# Altium schematic sheet FPGA_Board_Input_Signals.SchDoc
size B; Organization: Altium Limited; Address1: L3, 12a Rodborough Rd; Address2: Frenchs Forest; Address3: NSW; Address4: Australia 2086; DocumentNumber: 12; SheetNumber: 9; SheetTotal: 21
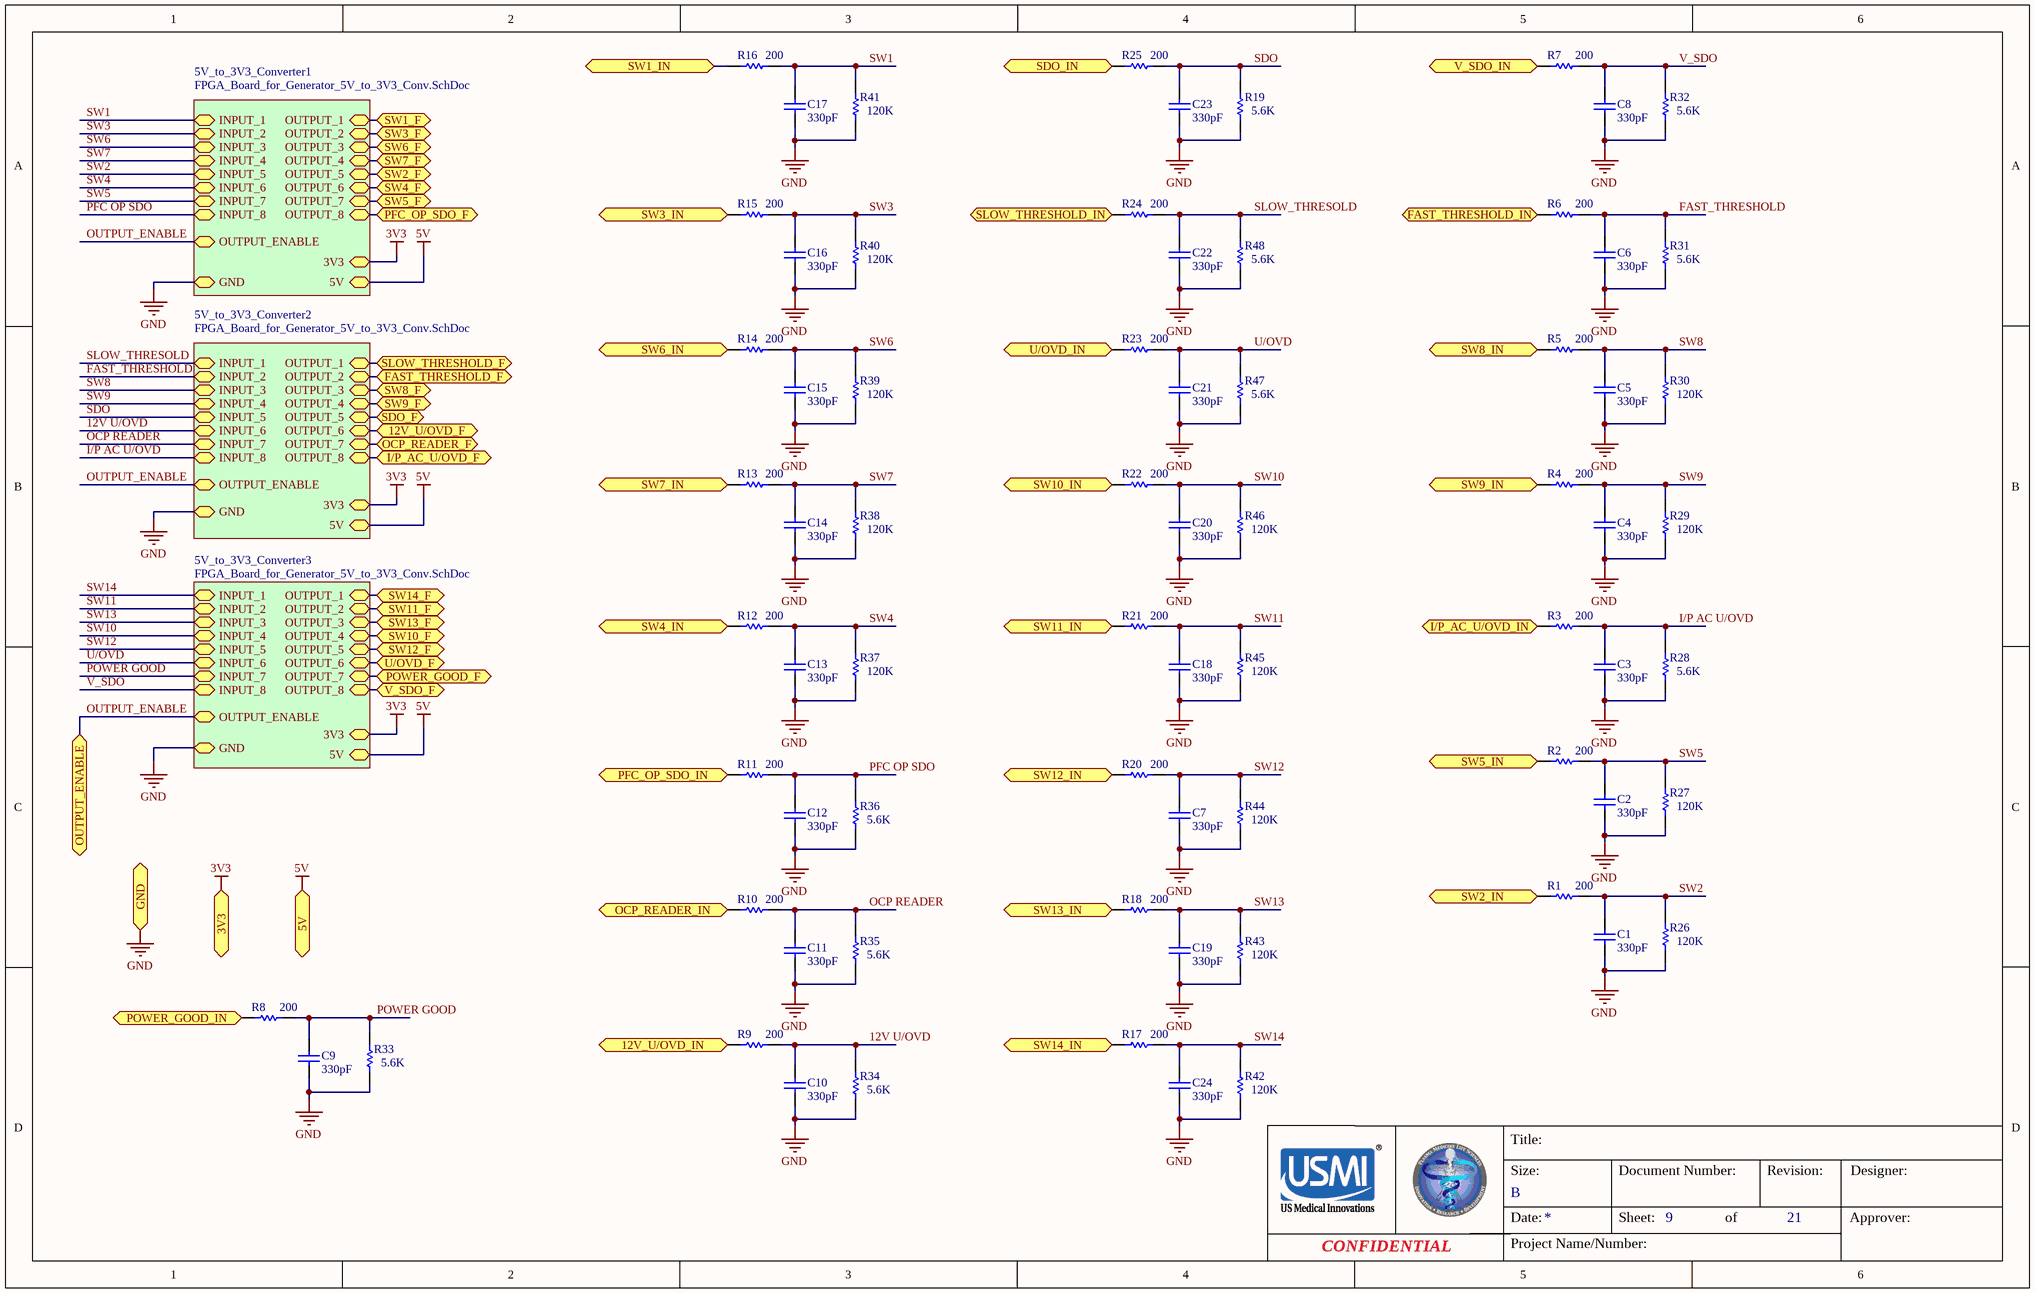
[diagram p0: FPGA_Board_Input_Signals.SchDoc]

## Parts
C1  330pF  [0603c]
C2  330pF  [0603c]
C3  330pF  [0603c]
C4  330pF  [0603c]
C5  330pF  [0603c]
C6  330pF  [0603c]
C7  330pF  [0603c]
C8  330pF  [0603c]
C9  330pF  [0603c]
C10  330pF  [0603c]
C11  330pF  [0603c]
C12  330pF  [0603c]
C13  330pF  [0603c]
C14  330pF  [0603c]
C15  330pF  [0603c]
C16  330pF  [0603c]
C17  330pF  [0603c]
C18  330pF  [0603c]
C19  330pF  [0603c]
C20  330pF  [0603c]
C21  330pF  [0603c]
C22  330pF  [0603c]
C23  330pF  [0603c]
C24  330pF  [0603c]
R1  200  [0603R]
R2  200  [0603R]
R3  200  [0603R]
R4  200  [0603R]
R5  200  [0603R]
R6  200  [0603R]
R7  200  [0603R]
R8  200  [0603R]
R9  200  [0603R]
R10  200  [0603R]
R11  200  [0603R]
R12  200  [0603R]
R13  200  [0603R]
R14  200  [0603R]
R15  200  [0603R]
R16  200  [0603R]
R17  200  [0603R]
R18  200  [0603R]
R19  5.6K  [0603R]
R20  200  [0603R]
R21  200  [0603R]
R22  200  [0603R]
R23  200  [0603R]
R24  200  [0603R]
R25  200  [0603R]
R26  120K  [0603R]
R27  120K  [0603R]
R28  5.6K  [0603R]
R29  120K  [0603R]
R30  120K  [0603R]
R31  5.6K  [0603R]
R32  5.6K  [0603R]
R33  5.6K  [0603R]
R34  5.6K  [0603R]
R35  5.6K  [0603R]
R36  5.6K  [0603R]
R37  120K  [0603R]
R38  120K  [0603R]
R39  120K  [0603R]
R40  120K  [0603R]
R41  120K  [0603R]
R42  120K  [0603R]
R43  120K  [0603R]
R44  120K  [0603R]
R45  120K  [0603R]
R46  120K  [0603R]
R47  5.6K  [0603R]
R48  5.6K  [0603R]

## Sub-sheets
5V_to_3V3_Converter1 = FPGA_Board_for_Generator_5V_to_3V3_Conv.SchDoc: GND, 5V, 3V3, OUTPUT_1, OUTPUT_2, OUTPUT_3, OUTPUT_4, OUTPUT_5, OUTPUT_6, OUTPUT_7, OUTPUT_8, INPUT_1, INPUT_4, INPUT_5, INPUT_6, INPUT_2, INPUT_3, INPUT_7, INPUT_8, OUTPUT_ENABLE
5V_to_3V3_Converter2 = FPGA_Board_for_Generator_5V_to_3V3_Conv.SchDoc: INPUT_6, GND, 5V, 3V3, OUTPUT_ENABLE, INPUT_7, INPUT_8, INPUT_3, OUTPUT_6, OUTPUT_2, OUTPUT_8, OUTPUT_7, INPUT_5, INPUT_4, OUTPUT_5, OUTPUT_3, OUTPUT_1, OUTPUT_4, INPUT_1, INPUT_2
5V_to_3V3_Converter3 = FPGA_Board_for_Generator_5V_to_3V3_Conv.SchDoc: OUTPUT_ENABLE, INPUT_7, OUTPUT_1, INPUT_3, INPUT_8, OUTPUT_8, INPUT_6, OUTPUT_3, 5V, GND, OUTPUT_2, 3V3, OUTPUT_6, INPUT_5, INPUT_2, INPUT_1, INPUT_4, OUTPUT_7, OUTPUT_4, OUTPUT_5

## Ports
3V3, 5V, 12V_U/OVD_F, 12V_U/OVD_IN, FAST_THRESHOLD_F, FAST_THRESHOLD_IN, GND, I/P_AC_U/OVD_F, I/P_AC_U/OVD_IN, OCP_READER_F, OCP_READER_IN, OUTPUT_ENABLE, PFC_OP_SDO_F, PFC_OP_SDO_IN, POWER_GOOD_F, POWER_GOOD_IN, SDO_F, SDO_IN, SLOW_THRESHOLD_F, SLOW_THRESHOLD_IN, SW1_F, SW1_IN, SW2_F, SW2_IN, SW3_F, SW3_IN, SW4_F, SW4_IN, SW5_F, SW5_IN, SW6_F, SW6_IN, SW7_F, SW7_IN, SW8_F, SW8_IN, SW9_F, SW9_IN, SW10_F, SW10_IN, SW11_F, SW11_IN, SW12_F, SW12_IN, SW13_F, SW13_IN, SW14_F, SW14_IN, U/OVD_F, U/OVD_IN, V_SDO_F, V_SDO_IN

## Nets
3V3: port 3V3, sheet 5V_to_3V3_Converter1/3V3, sheet 5V_to_3V3_Converter2/3V3, sheet 5V_to_3V3_Converter3/3V3
5V: port 5V, sheet 5V_to_3V3_Converter1/5V, sheet 5V_to_3V3_Converter2/5V, sheet 5V_to_3V3_Converter3/5V
GND: C1.1 C2.1 C3.1 C4.1 C5.1 C6.1 C7.1 C8.1 C9.1 C10.1 C11.1 C12.1 C13.1 C14.1 C15.1 C16.1 C17.1 C18.1 C19.1 C20.1 C21.1 C22.1 C23.1 C24.1 R19.1 R26.1 R27.1 R28.1 R29.1 R30.1 R31.1 R32.1 R33.1 R34.1 R35.1 R36.1 R37.1 R38.1 R39.1 R40.1 R41.1 R42.1 R43.1 R44.1 R45.1 R46.1 R47.1 R48.1 ; port GND, sheet 5V_to_3V3_Converter1/GND, sheet 5V_to_3V3_Converter2/GND, sheet 5V_to_3V3_Converter3/GND
12V U/OVD: C10.2 R9.2 R34.2 ; sheet 5V_to_3V3_Converter2/INPUT_6
12V_U/OVD_F: port 12V_U/OVD_F, sheet 5V_to_3V3_Converter2/OUTPUT_6
12V_U/OVD_IN: R9.1 ; port 12V_U/OVD_IN
FAST_THRESHOLD: C6.2 R6.2 R31.2 ; sheet 5V_to_3V3_Converter2/INPUT_2
FAST_THRESHOLD_F: port FAST_THRESHOLD_F, sheet 5V_to_3V3_Converter2/OUTPUT_2
FAST_THRESHOLD_IN: R6.1 ; port FAST_THRESHOLD_IN
I/P AC U/OVD: C3.2 R3.2 R28.2 ; sheet 5V_to_3V3_Converter2/INPUT_8
I/P_AC_U/OVD_F: port I/P_AC_U/OVD_F, sheet 5V_to_3V3_Converter2/OUTPUT_8
I/P_AC_U/OVD_IN: R3.1 ; port I/P_AC_U/OVD_IN
OCP READER: C11.2 R10.2 R35.2 ; sheet 5V_to_3V3_Converter2/INPUT_7
OCP_READER_F: port OCP_READER_F, sheet 5V_to_3V3_Converter2/OUTPUT_7
OCP_READER_IN: R10.1 ; port OCP_READER_IN
OUTPUT_ENABLE: port OUTPUT_ENABLE, sheet 5V_to_3V3_Converter1/OUTPUT_ENABLE, sheet 5V_to_3V3_Converter2/OUTPUT_ENABLE, sheet 5V_to_3V3_Converter3/OUTPUT_ENABLE
PFC OP SDO: C12.2 R11.2 R36.2 ; sheet 5V_to_3V3_Converter1/INPUT_8
PFC_OP_SDO_F: port PFC_OP_SDO_F, sheet 5V_to_3V3_Converter1/OUTPUT_8
PFC_OP_SDO_IN: R11.1 ; port PFC_OP_SDO_IN
POWER GOOD: C9.2 R8.2 R33.2 ; sheet 5V_to_3V3_Converter3/INPUT_7
POWER_GOOD_F: port POWER_GOOD_F, sheet 5V_to_3V3_Converter3/OUTPUT_7
POWER_GOOD_IN: R8.1 ; port POWER_GOOD_IN
SDO: C23.2 R19.2 R25.2 ; sheet 5V_to_3V3_Converter2/INPUT_5
SDO_F: port SDO_F, sheet 5V_to_3V3_Converter2/OUTPUT_5
SDO_IN: R25.1 ; port SDO_IN
SLOW_THRESHOLD_F: port SLOW_THRESHOLD_F, sheet 5V_to_3V3_Converter2/OUTPUT_1
SLOW_THRESHOLD_IN: R24.1 ; port SLOW_THRESHOLD_IN
SLOW_THRESOLD: C22.2 R24.2 R48.2 ; sheet 5V_to_3V3_Converter2/INPUT_1
SW1: C17.2 R16.2 R41.2 ; sheet 5V_to_3V3_Converter1/INPUT_1
SW1_F: port SW1_F, sheet 5V_to_3V3_Converter1/OUTPUT_1
SW1_IN: R16.1 ; port SW1_IN
SW2: C1.2 R1.2 R26.2 ; sheet 5V_to_3V3_Converter1/INPUT_5
SW2_F: port SW2_F, sheet 5V_to_3V3_Converter1/OUTPUT_5
SW2_IN: R1.1 ; port SW2_IN
SW3: C16.2 R15.2 R40.2 ; sheet 5V_to_3V3_Converter1/INPUT_2
SW3_F: port SW3_F, sheet 5V_to_3V3_Converter1/OUTPUT_2
SW3_IN: R15.1 ; port SW3_IN
SW4: C13.2 R12.2 R37.2 ; sheet 5V_to_3V3_Converter1/INPUT_6
SW4_F: port SW4_F, sheet 5V_to_3V3_Converter1/OUTPUT_6
SW4_IN: R12.1 ; port SW4_IN
SW5: C2.2 R2.2 R27.2 ; sheet 5V_to_3V3_Converter1/INPUT_7
SW5_F: port SW5_F, sheet 5V_to_3V3_Converter1/OUTPUT_7
SW5_IN: R2.1 ; port SW5_IN
SW6: C15.2 R14.2 R39.2 ; sheet 5V_to_3V3_Converter1/INPUT_3
SW6_F: port SW6_F, sheet 5V_to_3V3_Converter1/OUTPUT_3
SW6_IN: R14.1 ; port SW6_IN
SW7: C14.2 R13.2 R38.2 ; sheet 5V_to_3V3_Converter1/INPUT_4
SW7_F: port SW7_F, sheet 5V_to_3V3_Converter1/OUTPUT_4
SW7_IN: R13.1 ; port SW7_IN
SW8: C5.2 R5.2 R30.2 ; sheet 5V_to_3V3_Converter2/INPUT_3
SW8_F: port SW8_F, sheet 5V_to_3V3_Converter2/OUTPUT_3
SW8_IN: R5.1 ; port SW8_IN
SW9: C4.2 R4.2 R29.2 ; sheet 5V_to_3V3_Converter2/INPUT_4
SW9_F: port SW9_F, sheet 5V_to_3V3_Converter2/OUTPUT_4
SW9_IN: R4.1 ; port SW9_IN
SW10: C20.2 R22.2 R46.2 ; sheet 5V_to_3V3_Converter3/INPUT_4
SW10_F: port SW10_F, sheet 5V_to_3V3_Converter3/OUTPUT_4
SW10_IN: R22.1 ; port SW10_IN
SW11: C18.2 R21.2 R45.2 ; sheet 5V_to_3V3_Converter3/INPUT_2
SW11_F: port SW11_F, sheet 5V_to_3V3_Converter3/OUTPUT_2
SW11_IN: R21.1 ; port SW11_IN
SW12: C7.2 R20.2 R44.2 ; sheet 5V_to_3V3_Converter3/INPUT_5
SW12_F: port SW12_F, sheet 5V_to_3V3_Converter3/OUTPUT_5
SW12_IN: R20.1 ; port SW12_IN
SW13: C19.2 R18.2 R43.2 ; sheet 5V_to_3V3_Converter3/INPUT_3
SW13_F: port SW13_F, sheet 5V_to_3V3_Converter3/OUTPUT_3
SW13_IN: R18.1 ; port SW13_IN
SW14: C24.2 R17.2 R42.2 ; sheet 5V_to_3V3_Converter3/INPUT_1
SW14_F: port SW14_F, sheet 5V_to_3V3_Converter3/OUTPUT_1
SW14_IN: R17.1 ; port SW14_IN
U/OVD: C21.2 R23.2 R47.2 ; sheet 5V_to_3V3_Converter3/INPUT_6
U/OVD_F: port U/OVD_F, sheet 5V_to_3V3_Converter3/OUTPUT_6
U/OVD_IN: R23.1 ; port U/OVD_IN
V_SDO: C8.2 R7.2 R32.2 ; sheet 5V_to_3V3_Converter3/INPUT_8
V_SDO_F: port V_SDO_F, sheet 5V_to_3V3_Converter3/OUTPUT_8
V_SDO_IN: R7.1 ; port V_SDO_IN

## Notes on the sheet
- Title:
- Size:
- Document Number:
- Revision:
- Designer:
- Date:
- Project Name/Number:
- B
- Sheet:
- of
- Approver:
- CONFIDENTIAL

## Library data of the parts
C1-C24 = Cap: Capacitor; Published: 8-Jun-2000; LatestRevisionDate: 17-Jul-2002; LatestRevisionNote: Re-released for DXP Platform.; PackageReference: RAD-0.3; Publisher: Altium Limited; PackageDescription: Radial Cap, Thru-Hole; 2 Leads; 0.3 in Pin Spacing; Value: 330pF; Supplier 1: Digi-Key; Supplier Part Number 1: 311-1186-1-ND
R1-R48 = Res1: Resistor; Published: 8-Jun-2000; LatestRevisionDate: 17-Jul-2002; LatestRevisionNote: Re-released for DXP Platform.; PackageReference: AXIAL-0.3; Publisher: Altium Limited; PackageDescription: Axial Device, Thru-Hole; 2 Leads; 0.3 in Pin Spacing; Supplier 1: Digi-Key
  R1-R18 R20-R25: Value: 200; Supplier Part Number 1: 311-200HRCT-ND
  R19 R28 R31-R36 R47 R48: Value: 5.6K; Supplier Part Number 1: YAG3622CT-ND
  R26 R27 R29 R30 R37-R46: Value: 120K; Supplier Part Number 1: 311-120KHRCT-ND